# EAGLE design esp12e_3V3 (EAGLE 6.5.0)
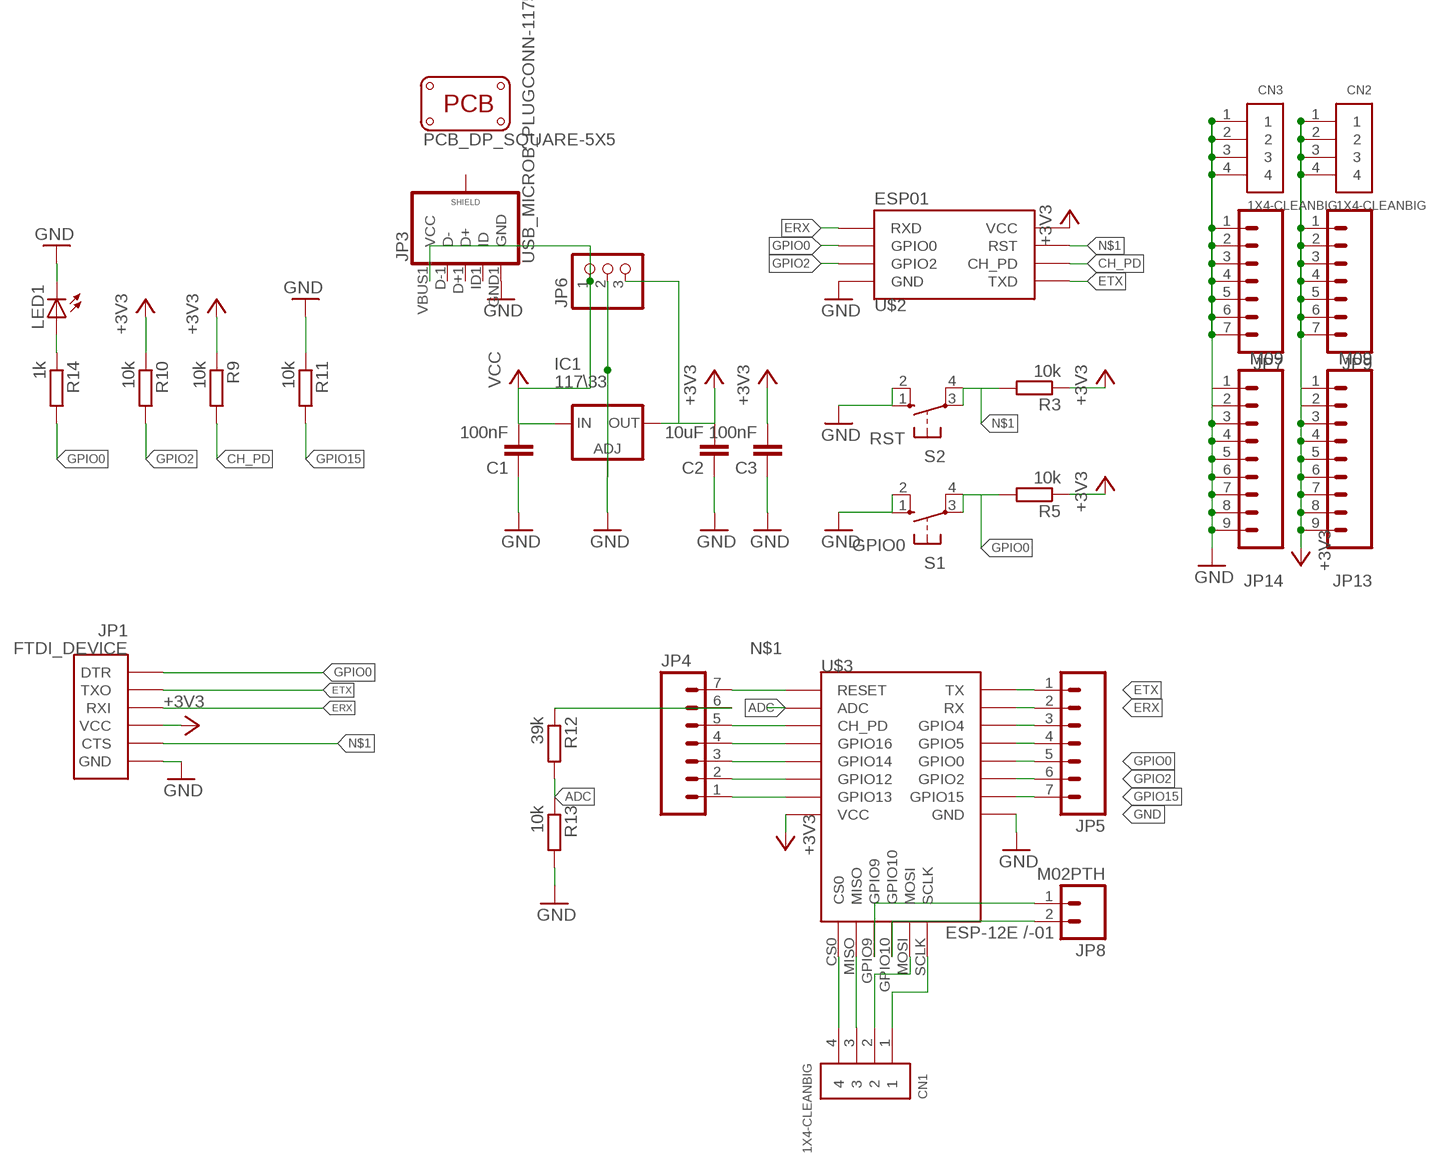
[diagram p0: schematic, sheet 1]

## Parts
C1  100nF  C-EUC1206  [C1206]
C2  10uF  C-EUC1206  [C1206]
C3  100nF  C-EUC1206  [C1206]
CN1  1X4-CLEANBIG  [1X04-CLEANBIG]
CN2  1X4-CLEANBIG  [1X04-CLEANBIG]
CN3  1X4-CLEANBIG  [1X04-CLEANBIG]
IC1  117\33  LD117AS33TR  [SOT223]
JP1  FTDI_DEVICE  [FTDI_DEVICE_SIDE]
JP3  USB_MICROB_PLUGCONN-11752  [USB-B-MICRO-SMD_V03]
JP4  M07  [1X07]
JP5  M07  [1X07]
JP6  PINHD-1X3  [1X03]
JP7  M07  [1X07]
JP8  M02PTH  [1X02]
JP9  M07  [1X07]
JP13  M09  [1X09]
JP14  M09  [1X09]
LED1  LEDSMT1206  [1206]
PCB1  PCB_DP_SQUARE-5X5  [DP5050_V1]
R3  10k  R-EU_M1206  [M1206]
R5  10k  R-EU_M1206  [M1206]
R9  10k  R-EU_M1206  [M1206]
R10  10k  R-EU_M1206  [M1206]
R11  10k  R-EU_M1206  [M1206]
R12  39k  R-EU_M1206  [M1206]
R13  10k  R-EU_M1206  [M1206]
R14  1k  R-EU_M1206  [M1206]
S1  GPIO0  10-XX  [B3F-10XX]
S2  RST  10-XX  [B3F-10XX]
U$2  ESP01  [ESP01]
U$3  ESP-12E /-01  ESP12E  [ESP12E]

## Nets
+3V3: C2.2 C3.2 CN2.1 CN2.2 CN2.3 CN2.4 IC1.4(OUT) JP1.P$4(VCC) JP6.3 JP9.1 JP9.2 JP9.3 JP9.4 JP9.5 JP9.6 JP9.7 JP13.1 JP13.2 JP13.3 JP13.4 JP13.5 JP13.6 JP13.7 JP13.8 JP13.9 R3.1 R5.1 R9.1 R10.1 U$2.VCC U$3.VCC
ADC: R12.2 R13.1 U$3.ADC
CH_PD: JP4.5 R9.2 U$2.CH_PD U$3.CH_PD
ERX: JP1.P$3(RXI) JP5.2 U$2.RX(RXD) U$3.RX
ETX: JP1.P$2(TXO) JP5.1 U$2.TX(TXD) U$3.TX
GND: C1.1 C2.1 C3.1 CN3.1 CN3.2 CN3.3 CN3.4 IC1.1(ADJ) JP1.P$6(GND) JP3.GND1(GND) JP6.2 JP7.1 JP7.2 JP7.3 JP7.4 JP7.5 JP7.6 JP7.7 JP14.1 JP14.2 JP14.3 JP14.4 JP14.5 JP14.6 JP14.7 JP14.8 JP14.9 LED1.C R11.1 R13.2 S1.1(S) S1.2(S1) S2.1(S) S2.2(S1) U$2.GND U$3.GND
GPIO0: JP1.P$1(DTR) JP5.5 R5.2 R14.2 S1.3(P) S1.4(P1) U$2.GPIO0 U$3.GPIO0
GPIO2: JP5.6 R10.2 U$2.GPIO2 U$3.GPIO2
GPIO15: JP5.7 R11.2 U$3.GPIO15
N$1: JP1.P$5(CTS) JP4.7 R3.2 S2.3(P) S2.4(P1) U$2.RST U$3.RESET
N$2: CN1.4 U$3.CS0
N$3: JP4.1 U$3.GPIO13
N$4: JP4.2 U$3.GPIO12
N$5: JP4.3 U$3.GPIO14
N$6: CN1.3 U$3.MISO
N$7: JP4.4 U$3.GPIO16
N$8: LED1.A R14.1
N$9: JP4.6 R12.1
N$10: CN1.2 U$3.MOSI
N$11: CN1.1 U$3.SCLK
N$14: JP5.4 U$3.GPIO5
N$15: JP5.3 U$3.GPIO4
N$16: JP8.1 U$3.GPIO9
N$17: JP8.2 U$3.GPIO10
VCC: C1.2 IC1.3(IN) JP3.VBUS1(VCC) JP6.1
Unconnected: JP3.D+1(D+) JP3.D-1(D-) JP3.ID1(ID) JP3.SHIELD1(SHIELD) JP3.SHIELD2(SHIELD) JP3.SHIELD3(SHIELD)

## Library data of the parts
C1-C3 = resistor:C-EU: CAPACITOR, European symbol
CN1-CN3 = adafruit:1X4: 4-pin connector
IC1 = v-reg:LD117A?*: Low drop fixed and adjustable positive voltage regulators 1 A Source: http://www.st.com/stonline/products/literature/ds/7194/ld1117axx.pdf
JP1 = SparkFun-Connectors:FTDI_DEVICE: Connector which mates to FTDI basic or FTDI cable.
JP3 = SparkFun-Connectors:USB_MICROB_PLUG: USB Micro-B connectors Some male, some female. Watch your step!; PROD_ID: CONN-11752
JP4 JP5 JP7 JP9 = SparkFun-Connectors:M07: Header 7 Standard 7-pin 0.1" header. Use with straight break away headers (SKU : PRT-00116), right angle break away headers (PRT-00553), swiss pins (PRT-00743), machine pins (PRT-00117), and female headers (PRT-00115). NOTES ON THE VARIANTS LOCK and LOCK_LONGPADS... This footprint was designed to help hold the alignment of a through-hole component (i.e. 7-pin header) while soldering it into place. You may notice that each hole has been shifted either up or down by 0.005 of an inch from it's more standard position (which is usually a perfectly straight line). This slight alteration caused the pins (the squares in the middle) to touch the edges of the holes. Because they are alternating, it causes a "brace" to hold the header in place. 0.005 has proven to be the perfect amount of "off-center" position when using our standard breakaway headers. Although looks a little odd when you look at the bare footprint, once you have a header in there, the alteration is very hard to notice. Also, if you push a header all the way into place, it is covered up entirely on the bottom side. This idea of altering the position of holes to aid alignment will be further integrated into the Sparkfun Library for other footprints. It can help hold any component with 3 or more connection pins.
JP6 = pinhead:PINHD-1X3: PIN HEADER
JP8 = SparkFun-Connectors:M02: Standard 2-pin 0.1" header. Use with - straight break away headers ( PRT-00116) - right angle break away headers (PRT-00553) - swiss pins (PRT-00743) - machine pins (PRT-00117) - female headers (PRT-00115) Molex polarized connector foot print use with: PRT-08233 with associated crimp pins and housings. 2.54_SCREWTERM for use with PRT-10571. 3.5mm Screw Terminal footprints for PRT-08084 5mm Screw Terminal footprints for use with PRT-08432
JP13 JP14 = SparkFun-Connectors:M09: Header 9 Standard 9-pin 0.1" header. Use with straight break away headers (SKU : PRT-00116), right angle break away headers (PRT-00553), swiss pins (PRT-00743), machine pins (PRT-00117), and female headers (PRT-00115).
LED1 = led:LED: LED OSRAM: - CHIPLED LG R971, LG N971, LY N971, LG Q971, LY Q971, LO R971, LY R971 LH N974, LH R974 LS Q976, LO Q976, LY Q976 LO Q996 - Hyper CHIPLED LW Q18S LB Q993, LB Q99A, LB R99A - SideLED LS A670, LO A670, LY A670, LG A670, LP A670 LB A673, LV A673, LT A673, LW A673 LH A674 LY A675 LS A676, LA A676, LO A676, LY A676, LW A676 LS A679, LY A679, LG A679 - Hyper Micro SIDELED® LS Y876, LA Y876, LO Y876, LY Y876 LT Y87S - SmartLED LW L88C, LW L88S LB L89C, LB L89S, LG L890 LS L89K, LO L89K, LY L89K LS L896, LA L896, LO L896, LY L896 - TOPLED LS T670, LO T670, LY T670, LG T670, LP T670 LSG T670, LSP T670, LSY T670, LOP T670, LYG T670 LG T671, LOG T671, LSG T671 LB T673, LV T673, LT T673, LW T673 LH T674 LS T676, LA T676, LO T676, LY T676, LB T676, LH T676, LSB T676, LW T676 LB T67C, LV T67C, LT T67C, LS T67K, LO T67K, LY T67K, LW E67C LS E67B, LA E67B, LO E67B, LY E67B, LB E67C, LV E67C, LT E67C LW T67C LS T679, LY T679, LG T679 LS T770, LO T770, LY T770, LG T770, LP T770 LB T773, LV T773, LT T773, LW T773 LH T774 LS E675, LA E675, LY E675, LS T675 LS T776, LA T776, LO T776, LY T776, LB T776 LHGB T686 LT T68C, LB T68C - Hyper Mini TOPLED® LB M676 - Mini TOPLED Santana® LG M470 LS M47K, LO M47K, LY M47K Source: http://www.osram.convergy.de LUXEON: - LUMILED® LXK2-PW12-R00, LXK2-PW12-S00, LXK2-PW14-U00, LXK2-PW14-V00 LXK2-PM12-R00, LXK2-PM12-S00, LXK2-PM14-U00 LXK2-PE12-Q00, LXK2-PE12-R00, LXK2-PE12-S00, LXK2-PE14-T00, LXK2-PE14-U00 LXK2-PB12-K00, LXK2-PB12-L00, LXK2-PB12-M00, LXK2-PB14-N00, LXK2-PB14-P00, LXK2-PB14-Q00 LXK2-PR12-L00, LXK2-PR12-M00, LXK2-PR14-Q00, LXK2-PR14-R00 LXK2-PD12-Q00, LXK2-PD12-R00, LXK2-PD12-S00 LXK2-PH12-R00, LXK2-PH12-S00 LXK2-PL12-P00, LXK2-PL12-Q00, LXK2-PL12-R00 Source: www.luxeon.com KINGBRIGHT: KA-3528ASYC Source: www.kingbright.com
PCB1 = dp_pcb:PCB_DP_SQUARE: Dangerous Prototypes Standard Square PCB sizes
R3 R5 R9-R14 = resistor:R-EU_: RESISTOR, European symbol
S1 S2 = switch-omron:10-XX: OMRON SWITCH; MPN: B3F-1000; OC_FARNELL: 176432; OC_NEWARK: 36M3542
U$2 = esp8266modules:ESP01: ESP8266 Wifi module 01
U$3 = esp8266modules:ESP12E

## Board
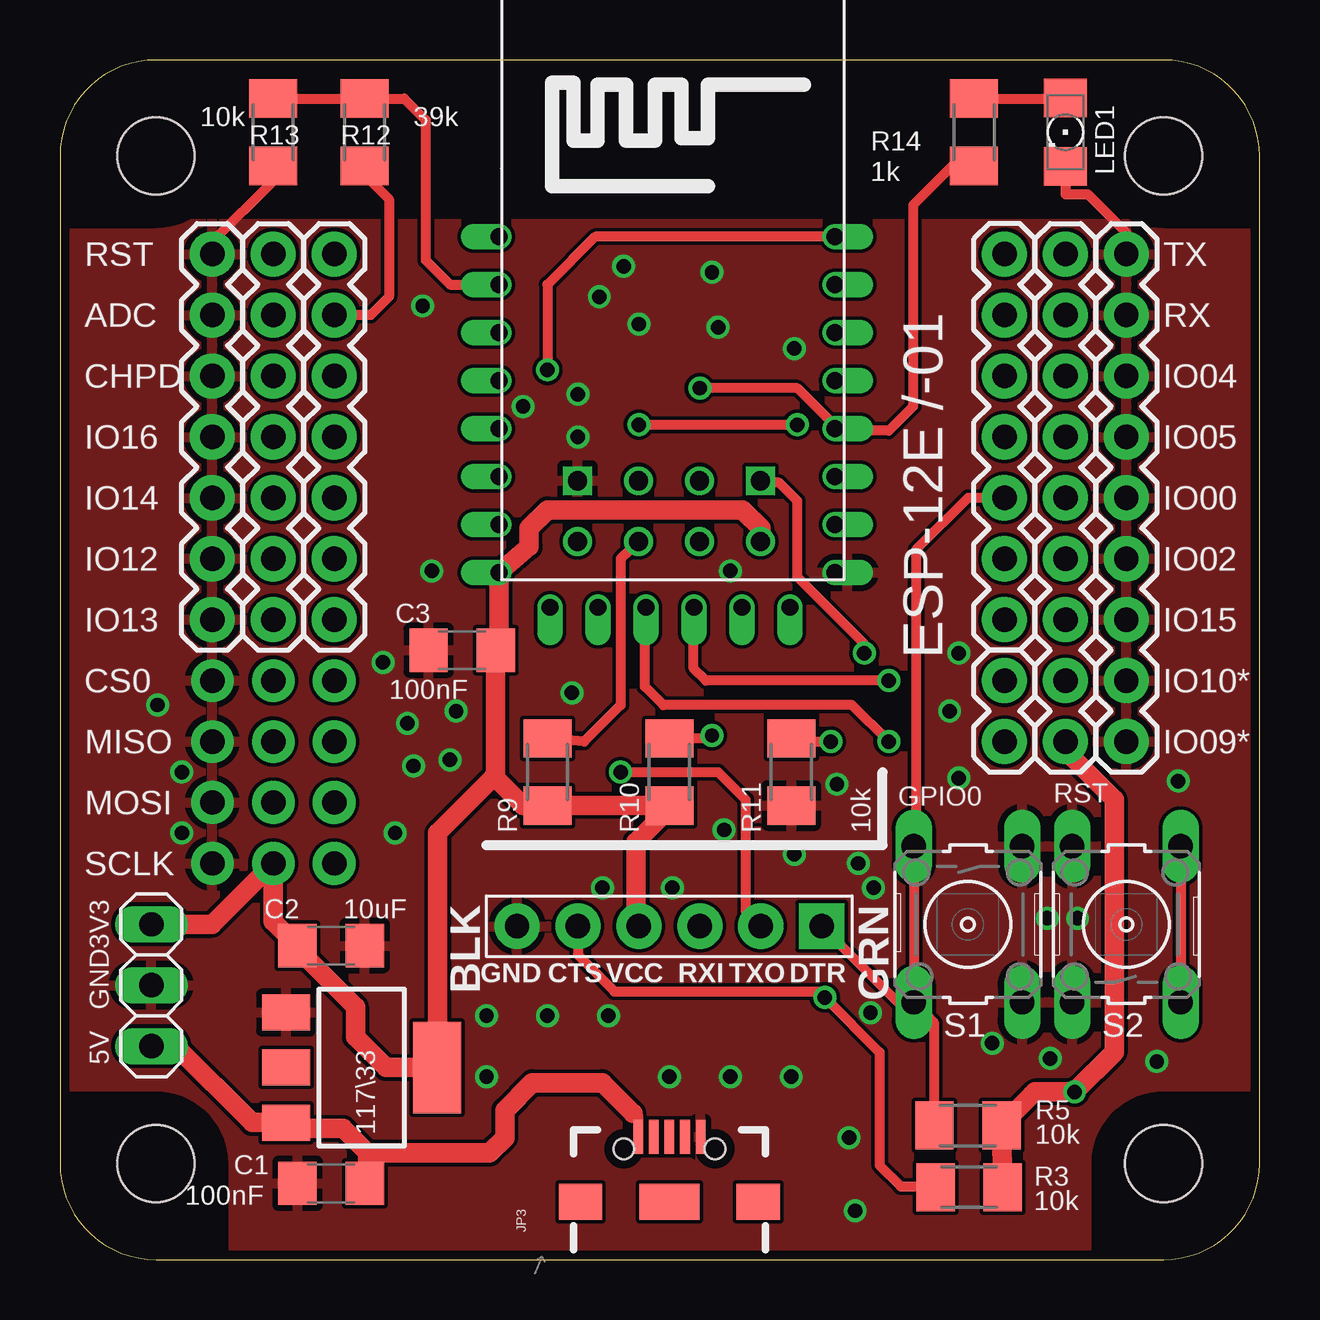
[diagram p1: board, top side]
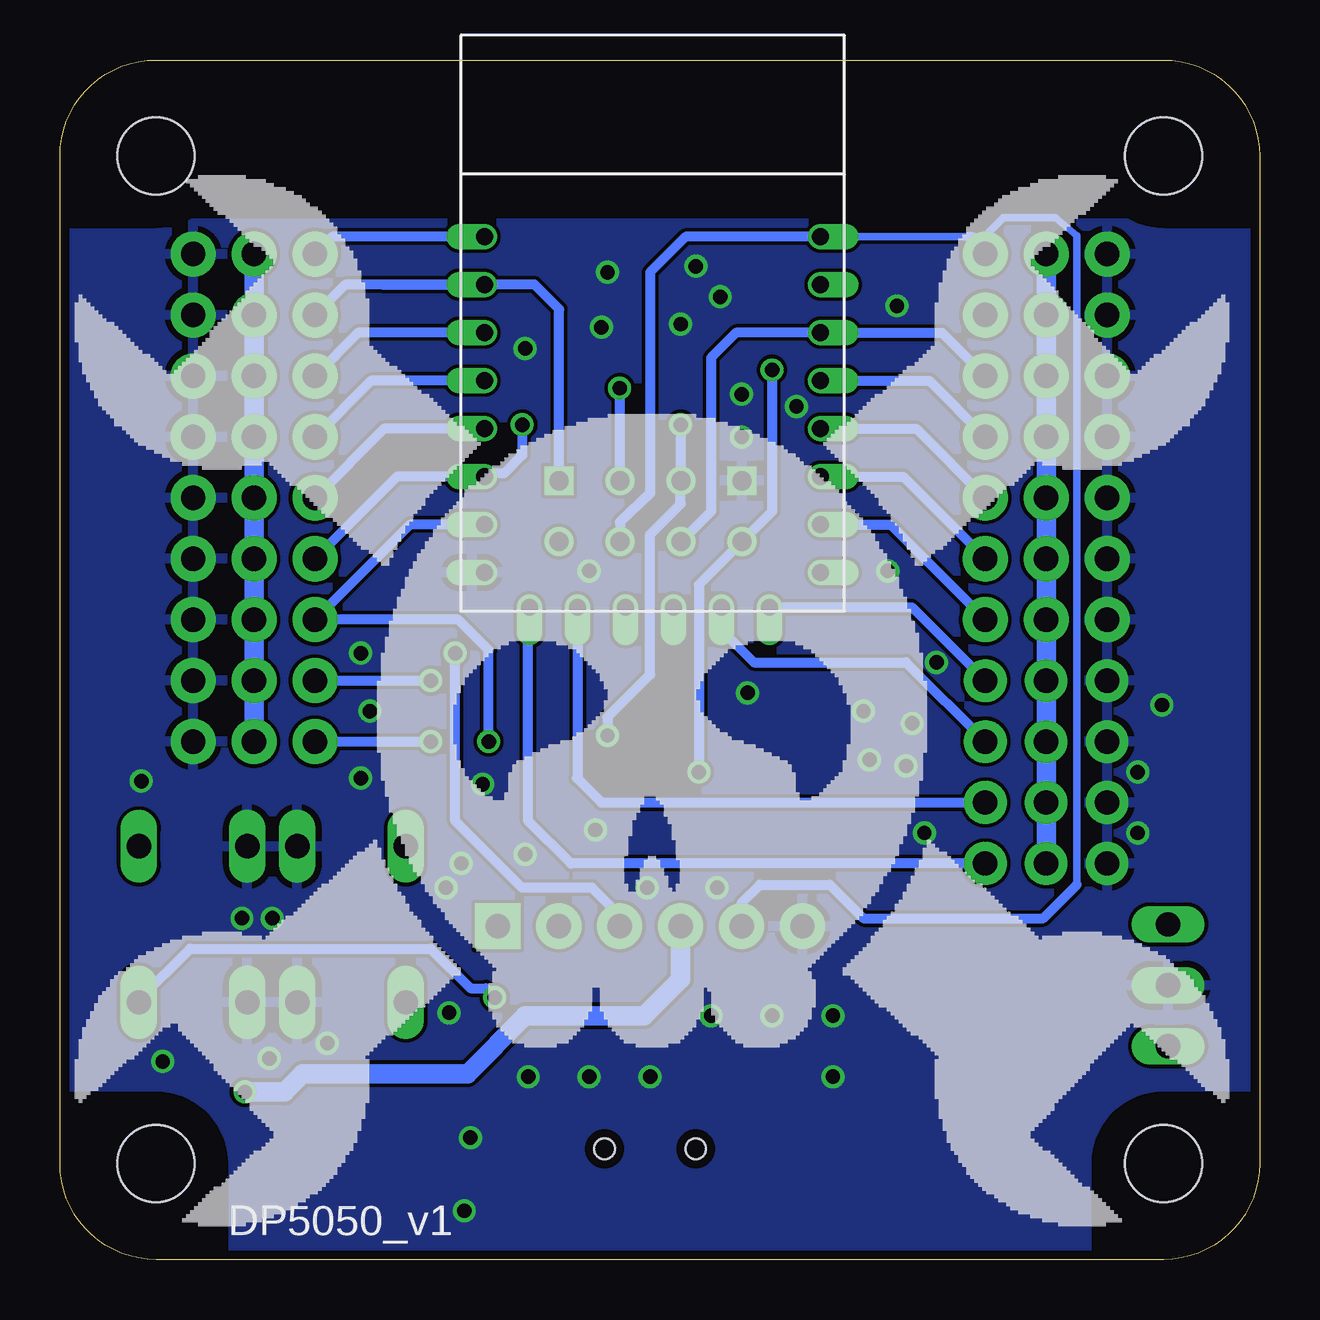
[diagram p2: board, bottom side, seen from below]

Size 50 x 50 mm. Coordinates in mm from the lower left corner, seen from the top.
Copper layers (1*16): Top 0.0356mm / dielectric 1.5011mm / Bottom 0.0356mm
Design rules "LaenPCBOrder *": minimum track width 6mil, minimum drill 13mil, track to track 6mil, track to pad 6mil, pad to pad 6mil, via to via 6mil, smd to smd 6mil, copper to edge 15mil, drill to drill 6mil, minimum pad ring 7mil, minimum via ring 7mil, stop-mask expansion 3mil, vias tented up to drill 1000mil, thermal gap 10mil

### Footprints (pad centres in the part's own frame; a part is rotated, then mirrored left to right if it is on the bottom)
C1206 = smd 1.6 x 1.8: 1 -1.4,0; 2 1.4,0
1X04-CLEANBIG = drill 1.016 pad 1.778: 1 -3.81,0; 2 -1.27,0; 3 1.27,0; 4 3.81,0
SOT223 = smd 1.5 x 2: 1 -2.3,-3.15; 2 0,-3.15; 3 2.3,-3.15 | smd 3.8 x 2: 4 0,3.15
FTDI_DEVICE_SIDE = drill 1.016 pad 1.88 square: P$1 -6.35,0 | drill 1.016 pad 1.88: P$2 -3.81,0; P$3 -1.27,0; P$4 1.27,0; P$5 3.81,0; P$6 6.35,0
USB-B-MICRO-SMD_V03 = smd 1.4 x 0.4: D+1 2.7,0; D-1 2.7,0.65; GND1 2.7,-1.3; ID1 2.7,-0.65; VBUS1 2.7,1.3 | smd 1.5 x 1.8: SHIELD1 0,3.7; SHIELD2 0,-3.7 | smd 1.5 x 2.5: SHIELD3 0,0 | hole 0.85: 2.2,1.9; 2.2,-1.9
1X07 = drill 1.016 pad 1.88: 1 0,0; 2 2.54,0; 3 5.08,0; 4 7.62,0; 5 10.16,0; 6 12.7,0; 7 15.24,0
1X03 = drill 1.016 long: 1 -2.54,0; 2 0,0; 3 2.54,0
1X02 = drill 1.016 pad 1.88: 1 0,0; 2 2.54,0
1X09 = drill 1.016 pad 1.88: 1 0,0; 2 2.54,0; 3 5.08,0; 4 7.62,0; 5 10.16,0; 6 12.7,0; 7 15.24,0; 8 17.78,0; 9 20.32,0
1206 = smd 1.6 x 1.803: A -1.422,0; C 1.422,0
DP5050_V1 = hole 3.2: 4,4; 46,4; 46,46; 4,46
M1206 = smd 1.6 x 2: 1 -1.4,0; 2 1.4,0
B3F-10XX = drill 1.016 long: 1 -3.251,2.261; 2 3.251,2.261; 3 -3.251,-2.261; 4 3.251,-2.261
ESP01 = drill 0.8: CH_PD -1.285,-8.178; GPIO0 1.255,-5.638; GPIO2 -1.285,-5.638; RST 1.255,-8.178; TX -3.825,-8.178; VCC 3.795,-8.178 | drill 0.8 square: GND -3.825,-5.638; RX 3.795,-5.638
ESP12E = drill 0.7 offset: ADC -7.1,3.8; CH_PD -7.1,1.8; CS0 -4.975,-9.64; GND 6.9,-8.2; GPIO0 6.9,-2.2; GPIO2 6.9,-4.2; GPIO4 6.9,1.8; GPIO5 6.9,-0.2; GPIO9 -0.975,-9.64; GPIO10 1.025,-9.64; GPIO12 -7.1,-4.2; GPIO13 -7.1,-6.2; GPIO14 -7.1,-2.2; GPIO15 6.9,-6.2; GPIO16 -7.1,-0.2; MISO -2.975,-9.64; MOSI 3.025,-9.64; RESET -7.1,5.8; RX 6.9,3.8; SCLK 5.025,-9.64; TX 6.9,5.8; VCC -7.1,-8.2

### Placement (x,y rotation side)
C1  11.3,3.17 0 top
C2  11.3,13.08 180 top
C3  16.76,25.4 0 top
CN1  11.43,20.32 90 top
CN2  8.89,20.32 90 top
CN3  6.35,20.32 90 top
IC1  12.57,8 270 top
JP1  25.4,13.89 180 top
JP3  25.4,2.41 90 top
JP4  11.43,26.67 90 top
JP5  39.37,41.91 270 top
JP6  3.81,11.43 90 top
JP7  6.35,26.67 90 top
JP8  39.37,21.59 90 top
JP9  8.89,26.67 90 top
JP13  41.91,21.59 90 top
JP14  44.45,21.59 90 top
LED1  41.91,46.99 270 top
PCB1  0,0 0 top
R3  37.89,3.02 180 top
R5  37.85,5.59 180 top
R9  20.32,20.32 90 top
R10  25.4,20.32 90 top
R11  30.48,20.32 90 top
R12  12.7,46.99 90 top
R13  8.89,46.99 270 top
R14  38.1,46.99 270 top
S1  37.85,13.97 270 top
S2  44.45,13.97 90 top
U$2  25.4,38.1 0 top
U$3  25.4,36.83 0 top

### Tracks (layer width: path | path; a pad name or v marks a point on that pad's centre or on a via)
+3V3  (via drill 0.6)
  Top 0.406: C2.2 9.9,12.96 | 15.62,8.1 IC1.4
  Top 0.813: 9.9,12.96 12.32,10.54 12.32,9.27 13.59,8 15.11,8 | 15.11,8 IC1.4 | R3.1 R5.1 40.64,6.99 v42.29,6.99 | U$2.VCC 29.21,30.48 28.45,31.24 20.32,31.24 19.56,30.48 19.56,29.72 U$3.VCC 18.3,25.54 C3.2 18.16,20.06 | C2.2 8.89,14.09 CN2.1 6.35,13.97 JP6.3 | 18.16,20.06 19.3,18.92 R9.1 R10.1 25.4,18.8 24,17.4 24,14.02 JP1.P$4 | 18.16,20.06 18.03,20.06 15.75,17.78 15.75,8.64 15.11,8 | JP13.1 41.91,21.21 43.94,19.18 43.94,8.64 v42.29,6.99 | v42.29,6.99 40.64,6.99 40.51,6.86
  Bottom 0.813: JP13.9 JP13.8 JP13.7 JP13.6 JP13.5 JP13.4 JP13.3 JP13.2 JP13.1 | JP9.7 JP9.6 JP9.5 JP9.4 JP9.3 JP9.2 JP9.1 CN2.4 CN2.3 CN2.2 CN2.1 8.76,16.64 | JP1.P$4 24.13,11.68 25.65,10.16 30.61,10.16 33.02,7.75 39.88,7.75 40.64,6.99 v42.29,6.99
ADC
  Top 0.406: R13.1 R12.2 14.35,48.39 15.24,47.5 15.24,41.66 16.26,40.64 U$3.ADC
CH_PD
  Top 0.406: U$2.CH_PD 23.37,29.21 23.37,23.11 21.84,21.59 R9.2
  Bottom 0.406: JP4.5 13.23,38.63 U$3.CH_PD 21.82,38.63 22.86,37.59 22.86,31.18 U$2.CH_PD
ERX  (via drill 0.6)
  Top 0.406: v33.53,25.27 33.53,25.65 30.73,28.45 30.73,31.62 29.97,32.38 29.27,32.38 U$2.RX
  Bottom 0.254: 36.58,40.64 38.1,40.64 38.1,40.63
  Bottom 0.406: JP5.2 38.11,40.63 38.1,40.63 U$3.RX 30.23,40.64 29.2,39.61 U$2.RX | 36.58,40.64 33.02,40.64 | JP1.P$3 26.67,14.35 27.81,15.49 30.73,15.49 33.53,18.29 v33.53,25.27
ETX  (via drill 0.6)
  Top 0.406: U$3.TX 22.31,42.63 20.32,40.64 v20.32,37.08 | v23.37,20.32 27.43,20.32 28.57,19.18 28.57,14.53 JP1.P$2
  Bottom 0.406: U$3.TX 38.65,42.63 JP5.1 | v23.37,20.32 23.37,28.13 U$2.TX 20.32,31.18 v20.32,37.08
GND  (via drill 0.6)
  Top 0.406: R13.2 8.89,44.96 6.35,42.42 JP7.7 | LED1.C 41.91,44.4 42.85,44.4 44.45,42.8 JP14.9 | R11.1 30.6,18.8 | 33.6,28.63 U$3.GND
  other vias: 21.59,36.07 21.59,34.29 19.3,35.56 16.51,22.86 14.73,20.57 13.97,17.78 14.48,22.35 5.08,17.78 5.08,20.32 16.26,20.83 21.34,23.62 4.06,23.11 37.47,20.07 46.61,19.94 33.91,15.49 32.38,19.81 32.89,5.08 33.15,2.03 27.94,28.7 30.61,16.89 33.27,16.51 41.15,14.22 42.42,14.22 38.86,9.02 41.27,8.38 45.72,8.26 37.08,22.86 37.47,25.27 27.18,41.15 22.48,40.13 27.43,38.86 24.13,38.99 23.5,41.4 15.11,39.75 13.46,24.89 27.69,17.91 25.53,15.49 22.61,15.49 33.78,10.29 30.61,37.97 30.48,7.62 27.94,7.62 20.32,10.16 17.78,10.16 17.78,7.62 15.49,28.7 25.4,7.62 22.86,10.16
  pour Top: -5.08,43.18 55.88,43.18 55.88,-5.08 -5.08,-5.08
  pour Bottom: -2.54,43.18 53.34,43.18 53.34,-2.54 -2.54,-2.54
GPIO0  (via drill 0.6)
  Top 0.406: R14.2 37.21,45.59 35.56,43.94 35.56,35.56 34.54,34.54 32.39,34.54 U$3.GPIO0 32.3,34.76 30.73,36.32 v26.67,36.32 | R5.2 36.45,9.86 S1.4 | S1.4 S1.3 35.69,17.37 35.69,29.59 37.85,31.75 JP5.5 | S1.4 34.92,10.72 JP1.P$1
  Bottom 0.406: U$3.GPIO0 36.49,34.63 JP5.5 | v26.67,36.32 26.67,32.48 U$2.GPIO0
GPIO2  (via drill 0.6)
  Top 0.406: v24.13,34.8 v30.73,34.8 | v27.18,21.84 27.05,21.72 R10.2
  Bottom 0.406: JP5.6 35.95,32.63 U$3.GPIO2 32.16,32.77 31.5,32.77 30.73,33.53 v30.73,34.8 | v24.13,34.8 24.11,34.78 U$2.GPIO2 24.13,31.5 25.4,30.23 25.4,24.38 27.18,22.61 v27.18,21.84
GPIO15  (via drill 0.6)
  Top 0.406: R11.2 30.61,21.59 v32.13,21.59
  Bottom 0.406: U$3.GPIO15 35.41,30.63 JP5.7 33.4,26.67 32.13,25.4 v32.13,21.59
N$1  (via drill 0.6)
  Top 0.406: S2.4 S2.3 | JP1.P$5 21.59,12.7 23.11,11.18 31.62,11.18 v31.88,10.92 34.16,8.64 34.16,3.94 35.05,3.05 36.46,3.05 R3.2
  Bottom 0.305: 7.62,15.62 7.62,42.67 8.51,43.43 10.67,43.43 11.43,42.67 JP4.7 | U$3.RESET 12.15,42.63
  Bottom 0.406: 12.15,42.63 arc90 JP4.7 | U$3.RESET 23.92,42.63 25.4,41.15 25.4,31.94 26.67,30.73 26.66,30.72 U$2.RST | JP1.P$5 21.59,14.86 20.83,15.62 17.91,15.62 16.51,14.22 9.02,14.22 7.62,15.62 | S2.3 46.71,10.82 44.58,12.95 34.54,12.95 32.89,11.3 32.26,11.3 v31.88,10.92
N$2
  Bottom 0.406: U$3.CS0 14.49,27.19 CN1.4
N$3
  Bottom 0.406: U$3.GPIO13 15.39,30.63 JP4.1
N$4
  Bottom 0.406: U$3.GPIO12 14.85,32.63 JP4.2
N$5
  Bottom 0.406: U$3.GPIO14 14.31,34.63 JP4.3
N$6
  Bottom 0.406: U$3.MISO 22.43,26.23 21.08,24.89 14.73,24.89 CN1.3
N$7
  Bottom 0.406: U$3.GPIO16 13.77,36.63 JP4.4
N$8
  Top 0.406: R14.1 41.89,48.39 LED1.A
N$9
  Top 0.406: R12.1 12.7,45.21 13.72,44.2 13.72,40.13 12.95,39.37 JP4.6
N$10
  Bottom 0.406: U$3.MOSI 28.43,20.09 28.45,20.07 27.43,19.05 CN1.2
N$11
  Bottom 0.406: CN1.1 28.7,16.51 30.48,18.29 30.48,27.14 U$3.SCLK
N$14
  Bottom 0.406: U$3.GPIO5 37.03,36.63 JP5.4
N$15
  Bottom 0.406: U$3.GPIO4 37.57,38.63 JP5.3
N$16  (via drill 0.6)
  Top 0.406: v34.54,21.59 33.02,23.11 25.15,23.11 24.38,23.88 24.38,27.15 U$3.GPIO9
  Bottom 0.406: JP8.1 v34.54,21.59
N$17  (via drill 0.6)
  Top 0.406: v34.54,24.13 26.92,24.13 26.42,24.64 U$3.GPIO10
  Bottom 0.406: JP8.2 v34.54,24.13
VCC
  Top 0.406: IC1.3 9.79,5.7 10.03,5.46 | 12.83,3.04 C1.2 | 23.88,6.1 24.1,6 JP3.VBUS1
  Top 0.813: 10.03,5.46 11.81,5.46 12.83,4.45 | 12.83,4.45 12.83,3.04 | 12.83,4.45 17.91,4.45 18.54,5.08 18.54,6.22 19.68,7.37 22.61,7.37 23.88,6.1 | IC1.3 9.41,5.71 8,5.71 4.83,8.89 JP6.1

### Text on the board
tNames: RST | TX | ADC | RX | CHPD | IO04 | IO16 | IO05 | IO14 | IO00 | IO12 | IO02 | IO13 | IO15 | CS0 | IO10* | 100nF | MISO | IO09* | MOSI | SCLK | 3V3 | GND | 5V